# Altium schematic sheet menger.v2sch.SchDoc
size 469 x 426 mm; Origin: Eagle
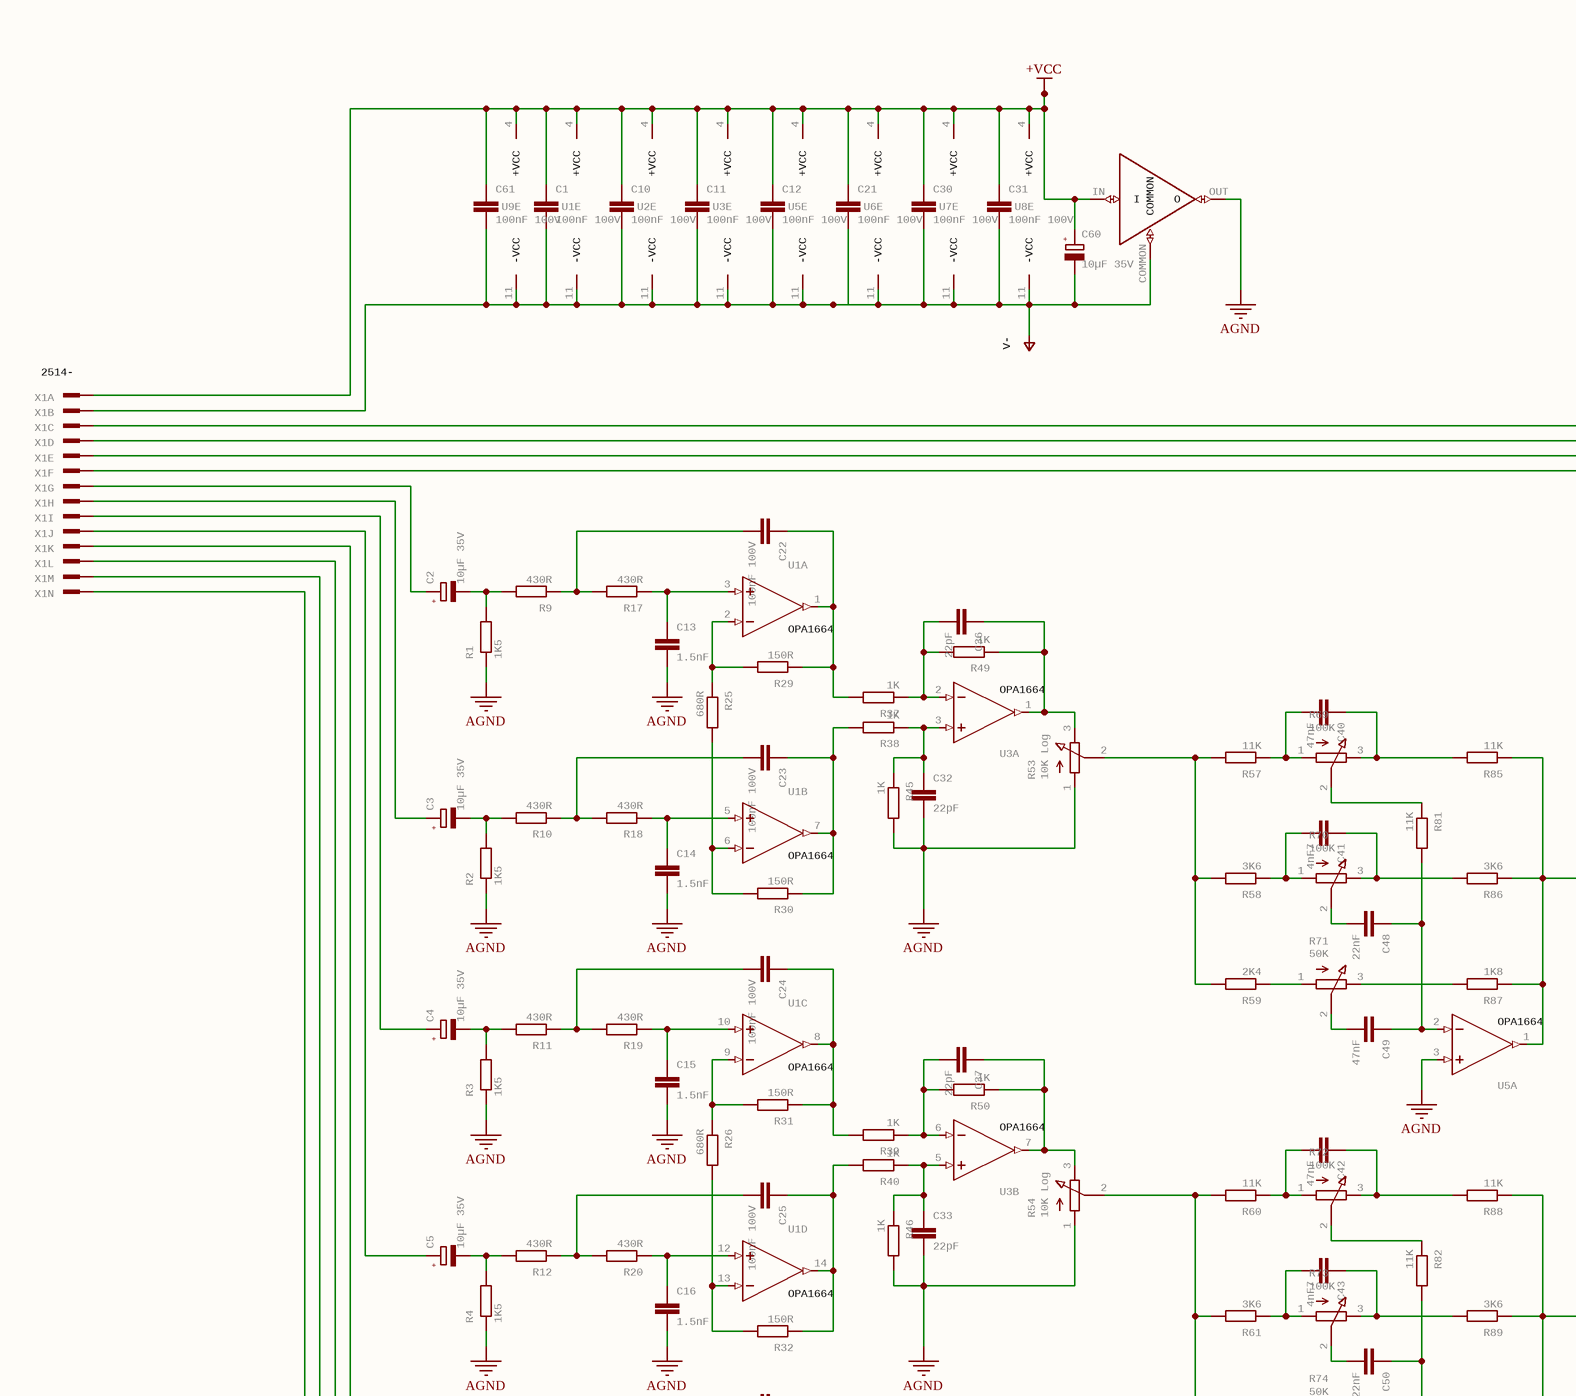
[diagram p0: menger.v2sch.SchDoc, top left]
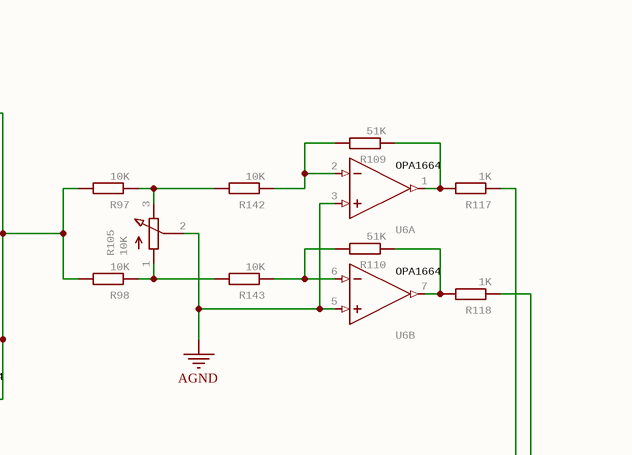
[diagram p1: menger.v2sch.SchDoc, top right]
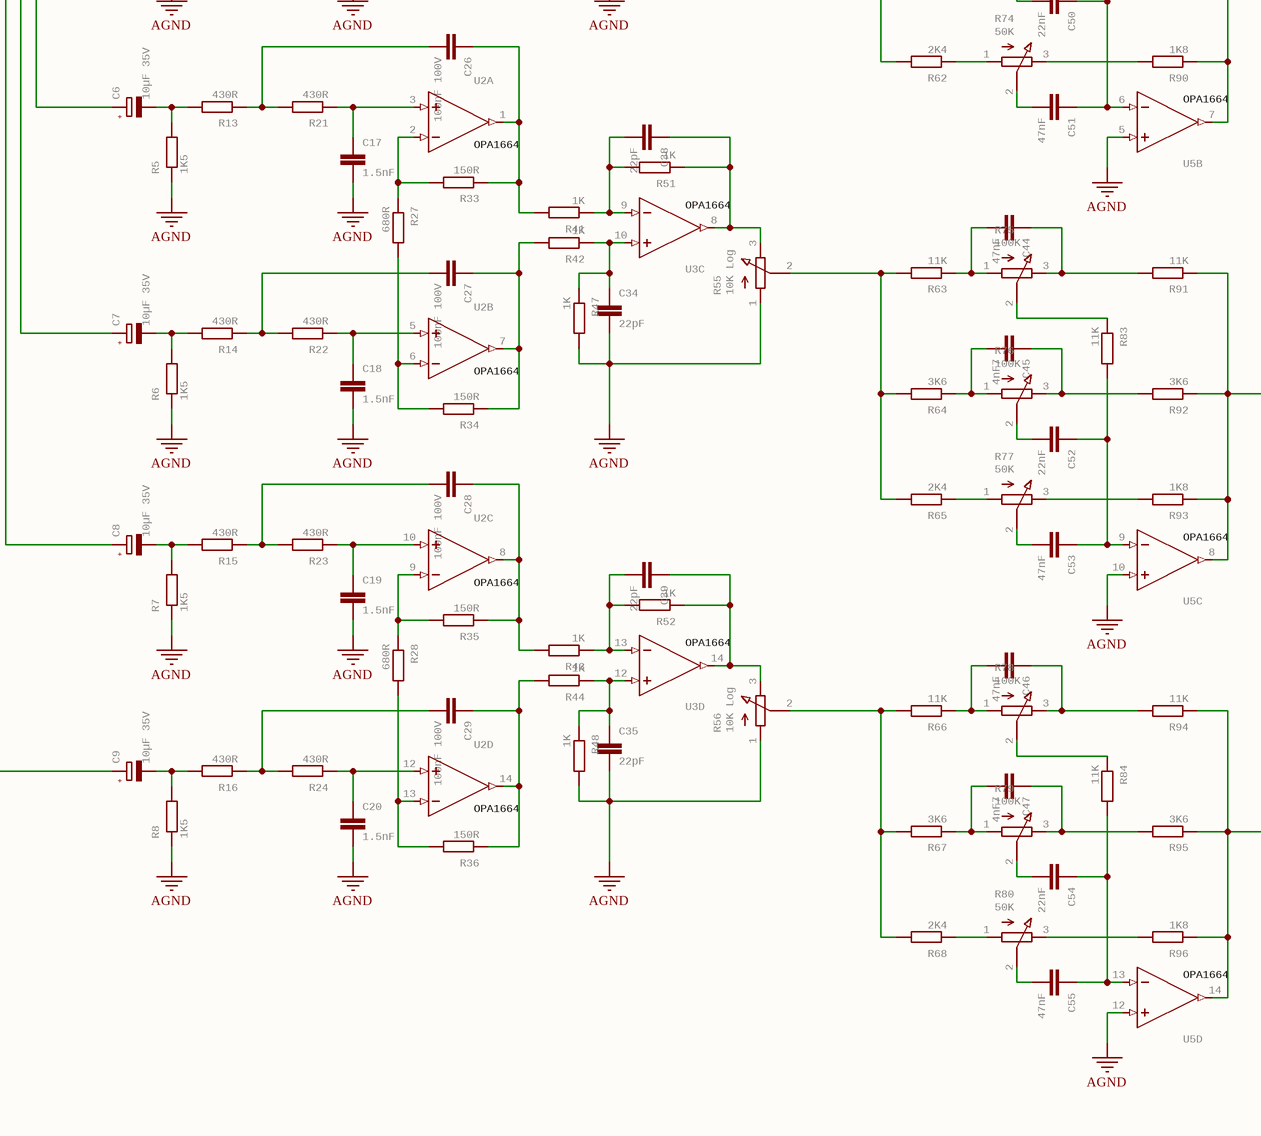
[diagram p2: menger.v2sch.SchDoc, bottom left]
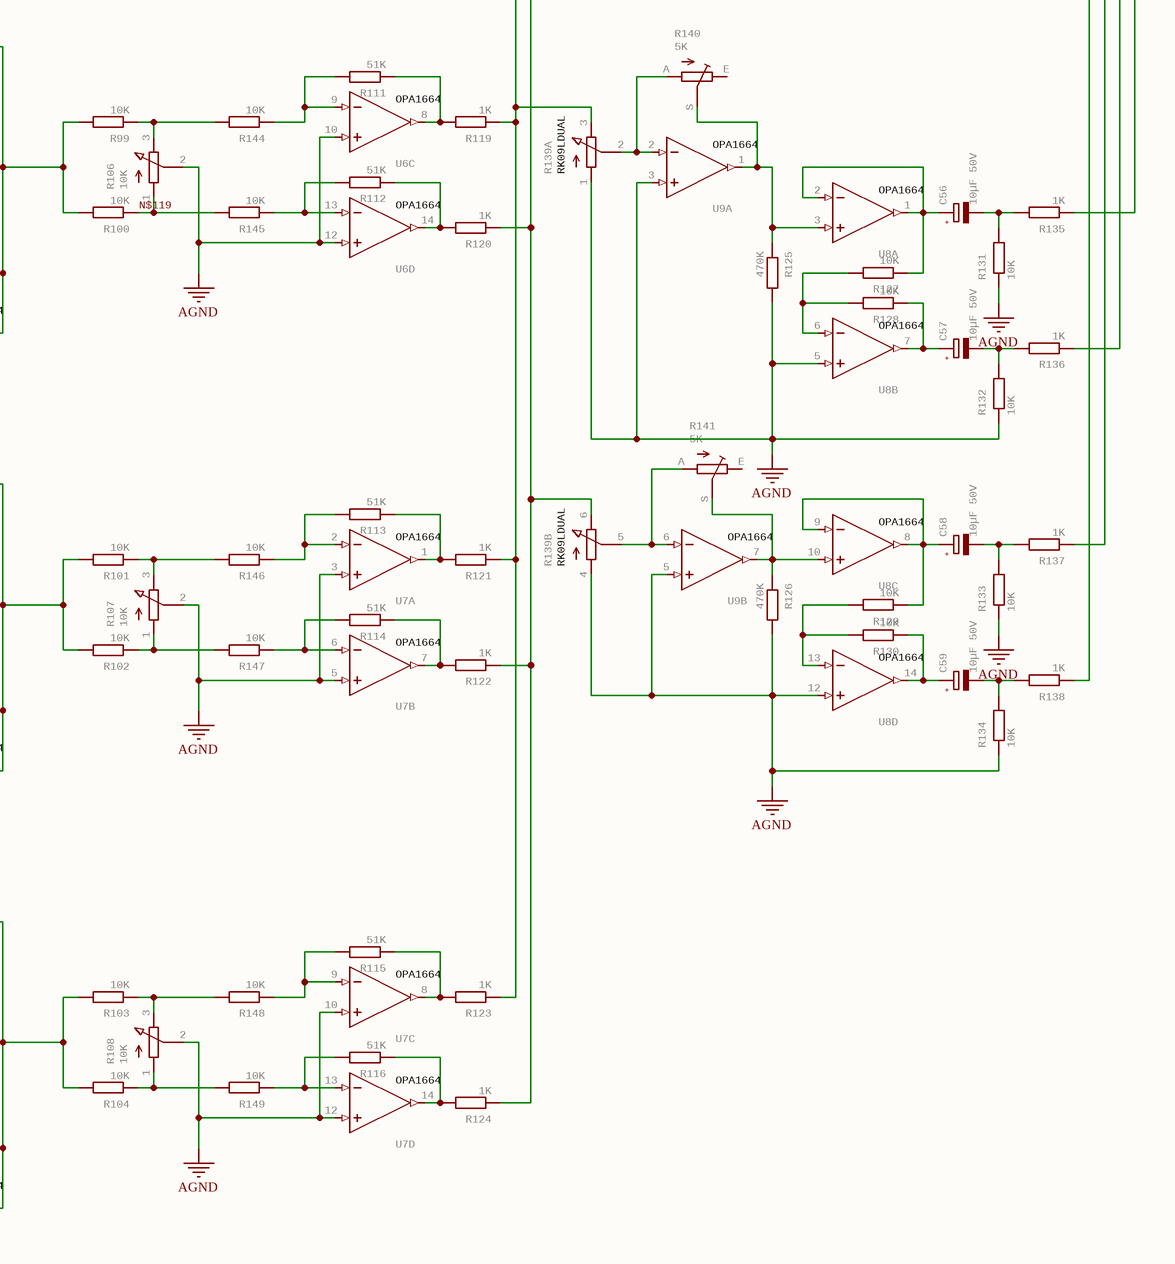
[diagram p3: menger.v2sch.SchDoc, bottom right]

## Parts
C1  value 100nF 100V  [C0805K]
C2  value 10µF 35V  [PANASONIC_B]
C3  value 10µF 35V  [PANASONIC_B]
C4  value 10µF 35V  [PANASONIC_B]
C5  value 10µF 35V  [PANASONIC_B]
C6  value 10µF 35V  [PANASONIC_B]
C7  value 10µF 35V  [PANASONIC_B]
C8  value 10µF 35V  [PANASONIC_B]
C9  value 10µF 35V  [PANASONIC_B]
C10  value 100nF 100V  [C0805K]
C11  value 100nF 100V  [C0805K]
C12  value 100nF 100V  [C0805K]
C13  value 1.5nF  [C0805]
C14  value 1.5nF  [C0805]
C15  value 1.5nF  [C0805]
C16  value 1.5nF  [C0805]
C17  value 1.5nF  [C0805]
C18  value 1.5nF  [C0805]
C19  value 1.5nF  [C0805]
C20  value 1.5nF  [C0805]
C21  value 100nF 100V  [C0805K]
C22  value 100nF 100V  [C0805]
C23  value 100nF 100V  [C0805]
C24  value 100nF 100V  [C0805]
C25  value 100nF 100V  [C0805]
C26  value 100nF 100V  [C0805]
C27  value 100nF 100V  [C0805]
C28  value 100nF 100V  [C0805]
C29  value 100nF 100V  [C0805]
C30  value 100nF 100V  [C0805K]
C31  value 100nF 100V  [C0805K]
C32  value 22pF  [C0805]
C33  value 22pF  [C0805]
C34  value 22pF  [C0805]
C35  value 22pF  [C0805]
C36  value 22pF  [C0805]
C37  value 22pF  [C0805]
C38  value 22pF  [C0805]
C39  value 22pF  [C0805]
C40  value 47nF  [C0805]
C41  value 4nF7  [C0805]
C42  value 47nF  [C0805]
C43  value 4nF7  [C0805]
C44  value 47nF  [C0805]
C45  value 4nF7  [C0805]
C46  value 47nF  [C0805]
C47  value 4nF7  [C0805]
C48  value 22nF  [C0805]
C49  value 47nF  [C0805]
C50  value 22nF  [C0805]
C51  value 47nF  [C0805]
C52  value 22nF  [C0805]
C53  value 47nF  [C0805]
C54  value 22nF  [C0805]
C55  value 47nF  [C0805]
C56  value 10µF 50V  [PANASONIC_B]
C57  value 10µF 50V  [PANASONIC_B]
C58  value 10µF 50V  [PANASONIC_B]
C59  value 10µF 50V  [PANASONIC_B]
C60  value 10µF 35V  [PANASONIC_B]
C61  value 100nF 100V  [C0805K]
P-1  V-
R1  value 1K5  [R0805]
R2  value 1K5  [R0805]
R3  value 1K5  [R0805]
R4  value 1K5  [R0805]
R5  value 1K5  [R0805]
R6  value 1K5  [R0805]
R7  value 1K5  [R0805]
R8  value 1K5  [R0805]
R9  value 430R  [R0805]
R10  value 430R  [R0805]
R11  value 430R  [R0805]
R12  value 430R  [R0805]
R13  value 430R  [R0805]
R14  value 430R  [R0805]
R15  value 430R  [R0805]
R16  value 430R  [R0805]
R17  value 430R  [R0805]
R18  value 430R  [R0805]
R19  value 430R  [R0805]
R20  value 430R  [R0805]
R21  value 430R  [R0805]
R22  value 430R  [R0805]
R23  value 430R  [R0805]
R24  value 430R  [R0805]
R25  value 680R  [R0805]
R26  value 680R  [R0805]
R27  value 680R  [R0805]
R28  value 680R  [R0805]
R29  value 150R  [R0805]
R30  value 150R  [R0805]
R31  value 150R  [R0805]
R32  value 150R  [R0805]
R33  value 150R  [R0805]
R34  value 150R  [R0805]
R35  value 150R  [R0805]
R36  value 150R  [R0805]
R37  value 1K  [R0805]
R38  value 1K  [R0805]
R39  value 1K  [R0805]
R40  value 1K  [R0805]
R41  value 1K  [R0805]
R42  value 1K  [R0805]
R43  value 1K  [R0805]
R44  value 1K  [R0805]
R45  value 1K  [R0805]
R46  value 1K  [R0805]
R47  value 1K  [R0805]
R48  value 1K  [R0805]
R49  value 1K  [R0805]
R50  value 1K  [R0805]
R51  value 1K  [R0805]
R52  value 1K  [R0805]
R53  value 10K Log  [RK09L1140A5E]
R54  value 10K Log  [RK09L1140A5E]
R55  value 10K Log  [RK09L1140A5E]
R56  value 10K Log  [RK09L1140A5E]
R57  value 11K  [R0805]
R58  value 3K6  [R0805]
R59  value 2K4  [R0805]
R60  value 11K  [R0805]
R61  value 3K6  [R0805]
R62  value 2K4  [R0805]
R63  value 11K  [R0805]
R64  value 3K6  [R0805]
R65  value 2K4  [R0805]
R66  value 11K  [R0805]
R67  value 3K6  [R0805]
R68  value 2K4  [R0805]
R69  value 100K  [RK09L1140A5E]
R70  value 100K  [RK09L1140A5E]
R71  value 50K  [RK09L1140A5E]
R72  value 100K  [RK09L1140A5E]
R73  value 100K  [RK09L1140A5E]
R74  value 50K  [RK09L1140A5E]
R75  value 100K  [RK09L1140A5E]
R76  value 100K  [RK09L1140A5E]
R77  value 50K  [RK09L1140A5E]
R78  value 100K  [RK09L1140A5E]
R79  value 100K  [RK09L1140A5E]
R80  value 50K  [RK09L1140A5E]
R81  value 11K  [R0805]
R82  value 11K  [R0805]
R83  value 11K  [R0805]
R84  value 11K  [R0805]
R85  value 11K  [R0805]
R86  value 3K6  [R0805]
R87  value 1K8  [R0805]
R88  value 11K  [R0805]
R89  value 3K6  [R0805]
R90  value 1K8  [R0805]
R91  value 11K  [R0805]
R92  value 3K6  [R0805]
R93  value 1K8  [R0805]
R94  value 11K  [R0805]
R95  value 3K6  [R0805]
R96  value 1K8  [R0805]
R97  value 10K  [R0805]
R98  value 10K  [R0805]
R99  value 10K  [R0805]
R100  value 10K  [R0805]
R101  value 10K  [R0805]
R102  value 10K  [R0805]
R103  value 10K  [R0805]
R104  value 10K  [R0805]
R105  value 10K  [RK09L1140A5E]
R106  value 10K  [RK09L1140A5E]
R107  value 10K  [RK09L1140A5E]
R108  value 10K  [RK09L1140A5E]
R109  value 51K  [R0805]
R110  value 51K  [R0805]
R111  value 51K  [R0805]
R112  value 51K  [R0805]
R113  value 51K  [R0805]
R114  value 51K  [R0805]
R115  value 51K  [R0805]
R116  value 51K  [R0805]
R117  value 1K  [R0805]
R118  value 1K  [R0805]
R119  value 1K  [R0805]
R120  value 1K  [R0805]
R121  value 1K  [R0805]
R122  value 1K  [R0805]
R123  value 1K  [R0805]
R124  value 1K  [R0805]
R125  value 470K  [R0805]
R126  value 470K  [R0805]
R127  value 10K  [R0805]
R128  value 10K  [R0805]
R129  value 10K  [R0805]
R130  value 10K  [R0805]
R131  value 10K  [R0805]
R132  value 10K  [R0805]
R133  value 10K  [R0805]
R134  value 10K  [R0805]
R135  value 1K  [R0805]
R136  value 1K  [R0805]
R137  value 1K  [R0805]
R138  value 1K  [R0805]
R139  RK09LDUAL  [RK09L1240A5E]  (parts A,B of 2)
R140  value 5K  [CA6V]
R141  value 5K  [CA6V]
R142  value 10K  [R0805]
R143  value 10K  [R0805]
R144  value 10K  [R0805]
R145  value 10K  [R0805]
R146  value 10K  [R0805]
R147  value 10K  [R0805]
R148  value 10K  [R0805]
R149  value 10K  [R0805]
U1  OPA1664  [D14]  (parts A,B,C,D,E of 5)
U2  OPA1664  [D14]  (parts A,B,C,D,E of 5)
U3  OPA1664  [D14]  (parts A,B,C,D,E of 5)
U4  TLE2426  [TO92TLE]  (value not drawn)
U5  OPA1664  [D14]  (parts A,B,C,D,E of 5)
U6  OPA1664  [D14]  (parts A,B,C,D,E of 5)
U7  OPA1664  [D14]  (parts A,B,C,D,E of 5)
U8  OPA1664  [D14]  (parts A,B,C,D,E of 5)
U9  OPA1664  [D14]  (parts A,B,E of 5)
X1  2514-  [PAK100/2500-14]  (parts A,B,C,D,E,F,G,H,I,J,K,L,M,N of 14)

## Nets
+VCC: C1.1 C10.1 C11.1 C12.1 C21.1 C30.1 C31.1 C60.+ C61.1 U1.4(+VCC) U2.4(+VCC) U3.4(+VCC) U4.IN(I) U5.4(+VCC) U6.4(+VCC) U7.4(+VCC) U8.4(+VCC) U9.4(+VCC) X1.1(KL)
AGND: C13.2 C14.2 C15.2 C16.2 C17.2 C18.2 C19.2 C20.2 C32.2 C33.2 C34.2 C35.2 R1.1 R2.1 R3.1 R4.1 R5.1 R6.1 R7.1 R8.1 R45.2 R46.2 R47.2 R48.2 R53.1 R54.1 R55.1 R56.1 R105.2 R106.2 R107.2 R108.2 R125.2 R126.2 R131.1 R132.1 R133.1 R134.1 R139.1 R139.4 U4.OUT(O) U5.3(+IN) U5.5(+IN) U5.10(+IN) U5.12(+IN) U6.3(+IN) U6.5(+IN) U6.10(+IN) U6.12(+IN) U7.3(+IN) U7.5(+IN) U7.10(+IN) U7.12(+IN) U8.5(+IN) U8.12(+IN) U9.3(+IN) U9.5(+IN)
N$119: R100.1 R106.1 R145.2
NetC1_2: C1.2 C10.2 C11.2 C12.2 C21.2 C30.2 C31.2 C60.- C61.2 P-1.?1(V-) U1.11(-VCC) U2.11(-VCC) U3.11(-VCC) U4.COMMON U5.11(-VCC) U6.11(-VCC) U7.11(-VCC) U8.11(-VCC) U9.11(-VCC) X1.2(KL)
NetC2_+: C2.+ X1.7(KL)
NetC2_-: C2.- R1.2 R9.2
NetC3_+: C3.+ X1.8(KL)
NetC3_-: C3.- R2.2 R10.2
NetC4_+: C4.+ X1.9(KL)
NetC4_-: C4.- R3.2 R11.2
NetC5_+: C5.+ X1.10(KL)
NetC5_-: C5.- R4.2 R12.2
NetC6_+: C6.+ X1.11(KL)
NetC6_-: C6.- R5.2 R13.2
NetC7_+: C7.+ X1.12(KL)
NetC7_-: C7.- R6.2 R14.2
NetC8_+: C8.+ X1.13(KL)
NetC8_-: C8.- R7.2 R15.2
NetC9_+: C9.+ X1.14(KL)
NetC9_-: C9.- R8.2 R16.2
NetC13_1: C13.1 R17.1 U1.3(+IN)
NetC14_1: C14.1 R18.1 U1.5(+IN)
NetC15_1: C15.1 R19.1 U1.10(+IN)
NetC16_1: C16.1 R20.1 U1.12(+IN)
NetC17_1: C17.1 R21.1 U2.3(+IN)
NetC18_1: C18.1 R22.1 U2.5(+IN)
NetC19_1: C19.1 R23.1 U2.10(+IN)
NetC20_1: C20.1 R24.1 U2.12(+IN)
NetC22_1: C22.1 R29.1 R37.2 U1.1(OUT)
NetC22_2: C22.2 R9.1 R17.2
NetC23_1: C23.1 R30.1 R38.2 U1.7(OUT)
NetC23_2: C23.2 R10.1 R18.2
NetC24_1: C24.1 R31.1 R39.2 U1.8(OUT)
NetC24_2: C24.2 R11.1 R19.2
NetC25_1: C25.1 R32.1 R40.2 U1.14(OUT)
NetC25_2: C25.2 R12.1 R20.2
NetC26_1: C26.1 R33.1 R41.2 U2.1(OUT)
NetC26_2: C26.2 R13.1 R21.2
NetC27_1: C27.1 R34.1 R42.2 U2.7(OUT)
NetC27_2: C27.2 R14.1 R22.2
NetC28_1: C28.1 R35.1 R43.2 U2.8(OUT)
NetC28_2: C28.2 R15.1 R23.2
NetC29_1: C29.1 R36.1 R44.2 U2.14(OUT)
NetC29_2: C29.2 R16.1 R24.2
NetC32_1: C32.1 R38.1 R45.1 U3.3(+IN)
NetC33_1: C33.1 R40.1 R46.1 U3.5(+IN)
NetC34_1: C34.1 R42.1 R47.1 U3.10(+IN)
NetC35_1: C35.1 R44.1 R48.1 U3.12(+IN)
NetC36_1: C36.1 R49.1 R53.3 U3.1(OUT)
NetC36_2: C36.2 R37.1 R49.2 U3.2(-IN)
NetC37_1: C37.1 R50.1 R54.3 U3.7(OUT)
NetC37_2: C37.2 R39.1 R50.2 U3.6(-IN)
NetC38_1: C38.1 R51.1 R55.3 U3.8(OUT)
NetC38_2: C38.2 R41.1 R51.2 U3.9(-IN)
NetC39_1: C39.1 R52.1 R56.3 U3.14(OUT)
NetC39_2: C39.2 R43.1 R52.2 U3.13(-IN)
NetC40_1: C40.1 R69.3 R85.2
NetC40_2: C40.2 R57.1 R69.1
NetC41_1: C41.1 R70.3 R86.2
NetC41_2: C41.2 R58.1 R70.1
NetC42_1: C42.1 R72.3 R88.2
NetC42_2: C42.2 R60.1 R72.1
NetC43_1: C43.1 R73.3 R89.2
NetC43_2: C43.2 R61.1 R73.1
NetC44_1: C44.1 R75.3 R91.2
NetC44_2: C44.2 R63.1 R75.1
NetC45_1: C45.1 R76.3 R92.2
NetC45_2: C45.2 R64.1 R76.1
NetC46_1: C46.1 R78.3 R94.2
NetC46_2: C46.2 R66.1 R78.1
NetC47_1: C47.1 R79.3 R95.2
NetC47_2: C47.2 R67.1 R79.1
NetC48_1: C48.1 C49.1 R81.2 U5.2(-IN)
NetC48_2: C48.2 R70.2
NetC49_2: C49.2 R71.2
NetC50_1: C50.1 C51.1 R82.2 U5.6(-IN)
NetC50_2: C50.2 R73.2
NetC51_2: C51.2 R74.2
NetC52_1: C52.1 C53.1 R83.2 U5.9(-IN)
NetC52_2: C52.2 R76.2
NetC53_2: C53.2 R77.2
NetC54_1: C54.1 C55.1 R84.2 U5.13(-IN)
NetC54_2: C54.2 R79.2
NetC55_2: C55.2 R80.2
NetC56_+: C56.+ R127.1 U8.1(OUT) U8.2(-IN)
NetC56_-: C56.- R131.2 R135.2
NetC57_+: C57.+ R128.1 U8.7(OUT)
NetC57_-: C57.- R132.2 R136.2
NetC58_+: C58.+ R129.1 U8.8(OUT) U8.9(-IN)
NetC58_-: C58.- R133.2 R137.2
NetC59_+: C59.+ R130.1 U8.14(OUT)
NetC59_-: C59.- R134.2 R138.2
NetR25_1: R25.1 R29.2 U1.2(-IN)
NetR25_2: R25.2 R30.2 U1.6(-IN)
NetR26_1: R26.1 R31.2 U1.9(-IN)
NetR26_2: R26.2 R32.2 U1.13(-IN)
NetR27_1: R27.1 R33.2 U2.2(-IN)
NetR27_2: R27.2 R34.2 U2.6(-IN)
NetR28_1: R28.1 R35.2 U2.9(-IN)
NetR28_2: R28.2 R36.2 U2.13(-IN)
NetR53_2: R53.2 R57.2 R58.2 R59.2
NetR54_2: R54.2 R60.2 R61.2 R62.2
NetR55_2: R55.2 R63.2 R64.2 R65.2
NetR56_2: R56.2 R66.2 R67.2 R68.2
NetR59_1: R59.1 R71.1
NetR62_1: R62.1 R74.1
NetR65_1: R65.1 R77.1
NetR68_1: R68.1 R80.1
NetR69_2: R69.2 R81.1
NetR71_3: R71.3 R87.2
NetR72_2: R72.2 R82.1
NetR74_3: R74.3 R90.2
NetR75_2: R75.2 R83.1
NetR77_3: R77.3 R93.2
NetR78_2: R78.2 R84.1
NetR80_3: R80.3 R96.2
NetR85_1: R85.1 R86.1 R87.1 R97.2 R98.2 U5.1(OUT)
NetR88_1: R88.1 R89.1 R90.1 R99.2 R100.2 U5.7(OUT)
NetR91_1: R91.1 R92.1 R93.1 R101.2 R102.2 U5.8(OUT)
NetR94_1: R94.1 R95.1 R96.1 R103.2 R104.2 U5.14(OUT)
NetR97_1: R97.1 R105.3 R142.2
NetR98_1: R98.1 R105.1 R143.2
NetR99_1: R99.1 R106.3 R144.2
NetR101_1: R101.1 R107.3 R146.2
NetR102_1: R102.1 R107.1 R147.2
NetR103_1: R103.1 R108.3 R148.2
NetR104_1: R104.1 R108.1 R149.2
NetR109_1: R109.1 R117.2 U6.1(OUT)
NetR109_2: R109.2 R142.1 U6.2(-IN)
NetR110_1: R110.1 R118.2 U6.7(OUT)
NetR110_2: R110.2 R143.1 U6.6(-IN)
NetR111_1: R111.1 R119.2 U6.8(OUT)
NetR111_2: R111.2 R144.1 U6.9(-IN)
NetR112_1: R112.1 R120.2 U6.14(OUT)
NetR112_2: R112.2 R145.1 U6.13(-IN)
NetR113_1: R113.1 R121.2 U7.1(OUT)
NetR113_2: R113.2 R146.1 U7.2(-IN)
NetR114_1: R114.1 R122.2 U7.7(OUT)
NetR114_2: R114.2 R147.1 U7.6(-IN)
NetR115_1: R115.1 R123.2 U7.8(OUT)
NetR115_2: R115.2 R148.1 U7.9(-IN)
NetR116_1: R116.1 R124.2 U7.14(OUT)
NetR116_2: R116.2 R149.1 U7.13(-IN)
NetR117_1: R117.1 R119.1 R121.1 R123.1 R139.3
NetR118_1: R118.1 R120.1 R122.1 R124.1 R139.6
NetR125_1: R125.1 R140.S U8.3(+IN) U9.1(OUT)
NetR126_1: R126.1 R141.S U8.10(+IN) U9.7(OUT)
NetR127_2: R127.2 R128.2 U8.6(-IN)
NetR129_2: R129.2 R130.2 U8.13(-IN)
NetR135_1: R135.1 X1.3(KL)
NetR136_1: R136.1 X1.4(KL)
NetR137_1: R137.1 X1.5(KL)
NetR138_1: R138.1 X1.6(KL)
NetR139_2: R139.2 R140.A U9.2(-IN)
NetR139_5: R139.5 R141.A U9.6(-IN)

Not connected (* = marked no-connect by the designer): R140 E; R141 E

## Library data of the parts
C1 C10-C12 C21 C30 C31 C61 = C-EUC0805K: CAPACITOR, European symbol; GateName_1: G$1; SymbolName_1: C-EU; DeviceName: C0805K; LibraryName: rcl; DeviceSetName: C-EU; SPICEPREFIX: C
C2-C9 C56-C60 = CPOL-EUB: POLARIZED CAPACITOR, European symbol; GateName_1: G$1; SymbolName_1: CPOL; DeviceName: B; LibraryName: rcl; DeviceSetName: CPOL-EU; +: +; SPICEPREFIX: C
C13-C20 C22-C29 C32-C55 = C-EUC0805: CAPACITOR, European symbol; GateName_1: G$1; SymbolName_1: C-EU; DeviceName: C0805; LibraryName: rcl; DeviceSetName: C-EU; SPICEPREFIX: C
P-1 = V-: SUPPLY SYMBOL; GateName_1: 1; SymbolName_1: V-; LibraryName: supply1; DeviceSetName: V-
R1-R52 R57-R68 R81-R104 R109-R138 R142-R149 = R-EU_R0805: RESISTOR, European symbol; GateName_1: G$1; SymbolName_1: R-EU; DeviceSetName: R-EU_; DeviceName: R0805; LibraryName: rcl; SPICEPREFIX: R
R53-R56 R69-R80 R105-R108 = RK09L: GateName_1: G$1; SymbolName_1: POT_EU-; LibraryName: SD_Pots; DeviceSetName: RK09L
R139 = RK09LDUAL: GateName_1: G$1; SymbolName_1: POT_EU-; GateName_2: G$2; SymbolName_2: POT_EU-; LibraryName: SD_Pots; DeviceSetName: RK09LDUAL
R140 R141 = TRIM_EU-CA6V: POTENTIOMETER; GateName_1: 1; SymbolName_1: TPOT; DeviceName: CA6V; LibraryName: pot; DeviceSetName: TRIM_EU-
U1-U3 U5-U9 = OPA1664: GateName_1: A; SymbolName_1: OP-AMP; GateName_2: B; GateName_3: C; GateName_4: D; GateName_5: E; SymbolName_5: +-VCC; SymbolName_2: OP-AMP; SymbolName_3: OP-AMP; SymbolName_4: OP-AMP; LibraryName: SD_Opamps; DeviceSetName: OPA1664
U4 = TLE2426: GateName_1: G$1; SymbolName_1: TLE2426; LibraryName: MyLib_SD; DeviceSetName: TLE2426
X1 = 2514-: 3M (TM) Pak 100 4-Wall Header   Source: 3M; GateName_1: -1; SymbolName_1: PINV; GateName_2: -2; SymbolName_2: PIN; GateName_3: -3; GateName_4: -4; GateName_5: -5; GateName_6: -6; GateName_7: -7; GateName_8: -8; GateName_9: -9; GateName_10: -10; GateName_11: -11; GateName_12: -12; GateName_13: -13; GateName_14: -14; SymbolName_3: PIN; SymbolName_4: PIN; SymbolName_5: PIN; SymbolName_6: PIN; SymbolName_7: PIN; SymbolName_8: PIN; SymbolName_9: PIN; SymbolName_10: PIN; SymbolName_11: PIN; SymbolName_12: PIN; SymbolName_13: PIN; SymbolName_14: PIN; LibraryName: con-3m; DeviceSetName: 2514-; MF: MF; MPN: MPN; OC_FARNELL: unknown; OC_NEWARK: unknown